# EAGLE design ARE_entrenadora_modular_doblecara_bis (EAGLE 6.1)
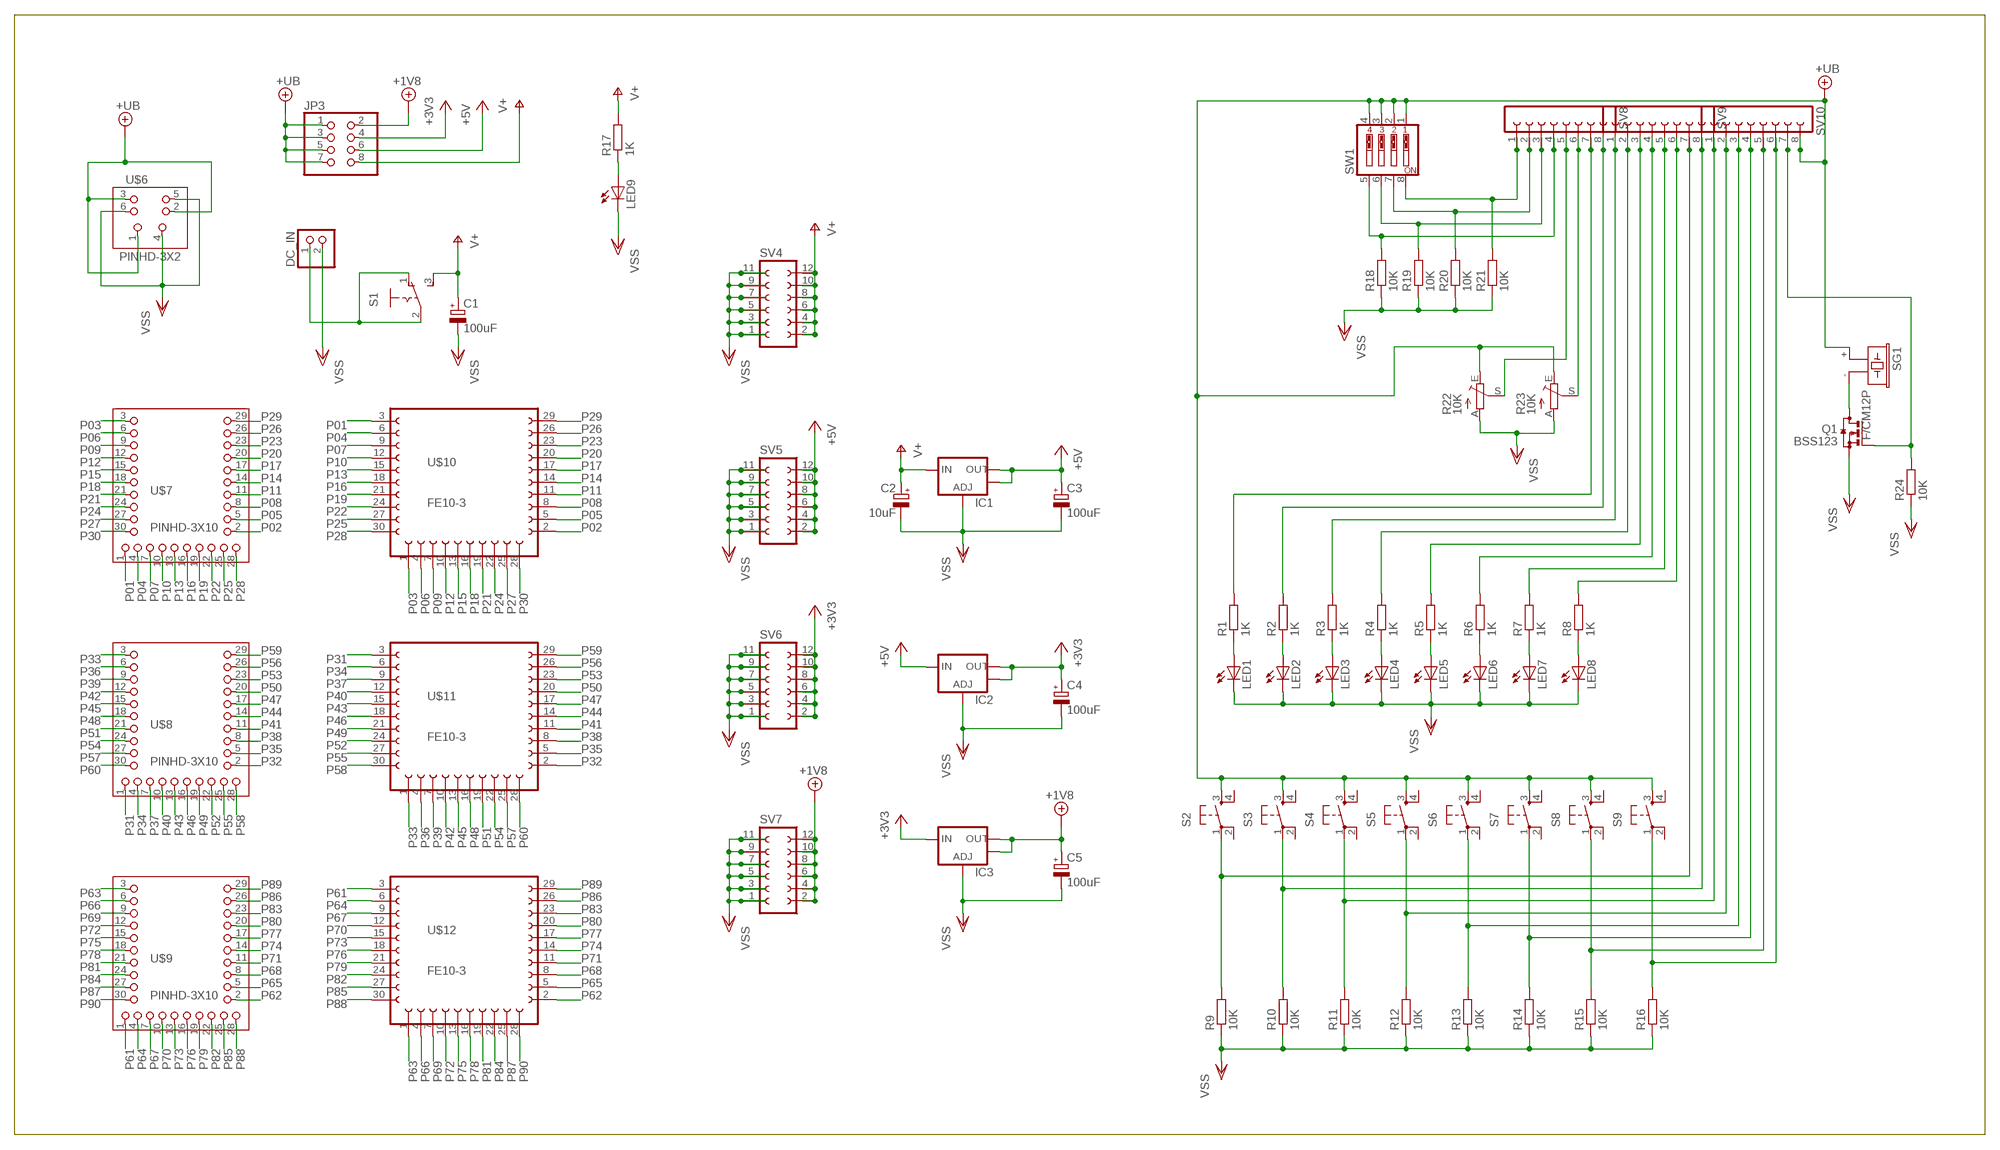
[diagram p0: schematic, sheet 1]

## Parts
C1  100uF  CPOL-EUE2.5-6  [E2,5-6]
C2  10uF  CPOL-EUSMCC  [SMC_C]
C3  100uF  CPOL-EUCT7343  [CT7343]
C4  100uF  CPOL-EUCT7343  [CT7343]
C5  100uF  CPOL-EUCT7343  [CT7343]
DC_IN  PINHD-1X2/90  [1X02/90]
IC1  V_REG_LM1117SOT223  [SOT223]
IC2  V_REG_LM1117SOT223  [SOT223]
IC3  V_REG_LM1117SOT223  [SOT223]
JP3  PINHD-2X4  [2X04]
LED1  LEDCHIP-LED0805  [CHIP-LED0805]
LED2  LEDCHIP-LED0805  [CHIP-LED0805]
LED3  LEDCHIP-LED0805  [CHIP-LED0805]
LED4  LEDCHIP-LED0805  [CHIP-LED0805]
LED5  LEDCHIP-LED0805  [CHIP-LED0805]
LED6  LEDCHIP-LED0805  [CHIP-LED0805]
LED7  LEDCHIP-LED0805  [CHIP-LED0805]
LED8  LEDCHIP-LED0805  [CHIP-LED0805]
LED9  LEDCHIP-LED0805  [CHIP-LED0805]
Q1  BSS123  [SOT23]
R1  1K  R-EU_R0805  [R0805]
R2  1K  R-EU_R0805  [R0805]
R3  1K  R-EU_R0805  [R0805]
R4  1K  R-EU_R0805  [R0805]
R5  1K  R-EU_R0805  [R0805]
R6  1K  R-EU_R0805  [R0805]
R7  1K  R-EU_R0805  [R0805]
R8  1K  R-EU_R0805  [R0805]
R9  10K  R-EU_R0805  [R0805]
R10  10K  R-EU_R0805  [R0805]
R11  10K  R-EU_R0805  [R0805]
R12  10K  R-EU_R0805  [R0805]
R13  10K  R-EU_R0805  [R0805]
R14  10K  R-EU_R0805  [R0805]
R15  10K  R-EU_R0805  [R0805]
R16  10K  R-EU_R0805  [R0805]
R17  1K  R-EU_R0805  [R0805]
R18  10K  R-EU_R0805  [R0805]
R19  10K  R-EU_R0805  [R0805]
R20  10K  R-EU_R0805  [R0805]
R21  10K  R-EU_R0805  [R0805]
R22  10K  TRIM_EU-CA6V  [CA6V]
R23  10K  TRIM_EU-CA6V  [CA6V]
R24  10K  R-EU_R0805  [R0805]
S1  255SB  [255SB]
S2  TAC_SWITCHPTH  [TACTILE-PTH]
S3  TAC_SWITCHPTH  [TACTILE-PTH]
S4  TAC_SWITCHPTH  [TACTILE-PTH]
S5  TAC_SWITCHPTH  [TACTILE-PTH]
S6  TAC_SWITCHPTH  [TACTILE-PTH]
S7  TAC_SWITCHPTH  [TACTILE-PTH]
S8  TAC_SWITCHPTH  [TACTILE-PTH]
S9  TAC_SWITCHPTH  [TACTILE-PTH]
SG1  F/CM12P  [F/CM12P]
SV4  FE06-2  [FE06-2]
SV5  FE06-2  [FE06-2]
SV6  FE06-2  [FE06-2]
SV7  FE06-2  [FE06-2]
SV8  FE08-1  [FE08]
SV9  FE08-1  [FE08]
SV10  FE08-1  [FE08]
SW1  SW_DIP-4  [EDG-04]
U$6  PINHD-3X2  [3X02/90]
U$7  PINHD-3X10  [3X10/90]
U$8  PINHD-3X10  [3X10/90]
U$9  PINHD-3X10  [3X10/90]
U$10  FE10-3  [FE10-3]
U$11  FE10-3  [FE10-3]
U$12  FE10-3  [FE10-3]

## Nets
+3V3: C4.+ IC2.2(OUT) IC2.4(OUT) IC3.3(IN) JP3.4 SV6.2 SV6.4 SV6.6 SV6.8 SV6.10 SV6.12
+5V: C3.+ IC1.2(OUT) IC1.4(OUT) IC2.3(IN) JP3.6 SV5.2 SV5.4 SV5.6 SV5.8 SV5.10 SV5.12
+18V: C5.+ IC3.2(OUT) IC3.4(OUT) JP3.2 SV7.2 SV7.4 SV7.6 SV7.8 SV7.10 SV7.12 ; supply symbol labelled +1V8
+UB: JP3.1 JP3.3 JP3.5 JP3.7 R22.E R23.E S2.3 S3.3 S4.3 S5.3 S6.3 S7.3 S8.3 S9.3 SG1.+ SV10.8 SW1.1 SW1.2 SW1.3 SW1.4 U$6.1 U$6.2 U$6.3
N$1: LED1.A R1.1
N$2: LED2.A R2.1
N$3: LED3.A R3.1
N$4: LED4.A R4.1
N$5: R2.2 SV8.8
N$6: R3.2 SV9.1
N$7: R1.2 SV8.7
N$8: R4.2 SV9.2
N$9: LED9.A R17.1
N$18: Q1.3(D) SG1.-
N$42: DC_IN.1 S1.1(O) S1.2(P)
N$43: LED5.A R5.1
N$44: LED6.A R6.1
N$45: LED7.A R7.1
N$46: LED8.A R8.1
N$47: R9.2 S2.1 SV9.7
N$48: R10.2 S3.1 SV9.8
N$49: R11.2 S4.1 SV10.1
N$50: R12.2 S5.1 SV10.2
N$51: R13.2 S6.1 SV10.3
N$52: R14.2 S7.1 SV10.4
N$53: R15.2 S8.1 SV10.5
N$54: R16.2 S9.1 SV10.6
N$55: Q1.1(G) R24.2 SV10.7
N$56: R23.S SV8.6
N$57: R22.S SV8.5
N$62: R6.2 SV9.4
N$63: R7.2 SV9.5
N$64: R5.2 SV9.3
N$65: R8.2 SV9.6
N$147: R18.2 SV8.4 SW1.5
N$148: R19.2 SV8.3 SW1.6
N$149: R20.2 SV8.2 SW1.7
N$150: R21.2 SV8.1 SW1.8
P01: U$7.1 U$10.3
P02: U$7.2 U$10.2
P03: U$7.3 U$10.1
P04: U$7.4 U$10.6
P05: U$7.5 U$10.5
P06: U$7.6 U$10.4
P07: U$7.7 U$10.9
P08: U$7.8 U$10.8
P09: U$7.9 U$10.7
P10: U$7.10 U$10.12
P11: U$7.11 U$10.11
P12: U$7.12 U$10.10
P13: U$7.13 U$10.15
P14: U$7.14 U$10.14
P15: U$7.15 U$10.13
P16: U$7.16 U$10.18
P17: U$7.17 U$10.17
P18: U$7.18 U$10.16
P19: U$7.19 U$10.21
P20: U$7.20 U$10.20
P21: U$7.21 U$10.19
P22: U$7.22 U$10.24
P23: U$7.23 U$10.23
P24: U$7.24 U$10.22
P25: U$7.25 U$10.27
P26: U$7.26 U$10.26
P27: U$7.27 U$10.25
P28: U$7.28 U$10.30
P29: U$7.29 U$10.29
P30: U$7.30 U$10.28
P31: U$8.1 U$11.3
P32: U$8.2 U$11.2
P33: U$8.3 U$11.1
P34: U$8.4 U$11.6
P35: U$8.5 U$11.5
P36: U$8.6 U$11.4
P37: U$8.7 U$11.9
P38: U$8.8 U$11.8
P39: U$8.9 U$11.7
P40: U$8.10 U$11.12
P41: U$8.11 U$11.11
P42: U$8.12 U$11.10
P43: U$8.13 U$11.15
P44: U$8.14 U$11.14
P45: U$8.15 U$11.13
P46: U$8.16 U$11.18
P47: U$8.17 U$11.17
P48: U$8.18 U$11.16
P49: U$8.19 U$11.21
P50: U$8.20 U$11.20
P51: U$8.21 U$11.19
P52: U$8.22 U$11.24
P53: U$8.23 U$11.23
P54: U$8.24 U$11.22
P55: U$8.25 U$11.27
P56: U$8.26 U$11.26
P57: U$8.27 U$11.25
P58: U$8.28 U$11.30
P59: U$8.29 U$11.29
P60: U$8.30 U$11.28
P61: U$9.1 U$12.3
P62: U$9.2 U$12.2
P63: U$9.3 U$12.1
P64: U$9.4 U$12.6
P65: U$9.5 U$12.5
P66: U$9.6 U$12.4
P67: U$9.7 U$12.9
P68: U$9.8 U$12.8
P69: U$9.9 U$12.7
P70: U$9.10 U$12.12
P71: U$9.11 U$12.11
P72: U$9.12 U$12.10
P73: U$9.13 U$12.15
P74: U$9.14 U$12.14
P75: U$9.15 U$12.13
P76: U$9.16 U$12.18
P77: U$9.17 U$12.17
P78: U$9.18 U$12.16
P79: U$9.19 U$12.21
P80: U$9.20 U$12.20
P81: U$9.21 U$12.19
P82: U$9.22 U$12.24
P83: U$9.23 U$12.23
P84: U$9.24 U$12.22
P85: U$9.25 U$12.27
P86: U$9.26 U$12.26
P87: U$9.27 U$12.25
P88: U$9.28 U$12.30
P89: U$9.29 U$12.29
P90: U$9.30 U$12.28
V+: C1.+ C2.+ IC1.3(IN) JP3.8 R17.2 S1.3(S) SV4.2 SV4.4 SV4.6 SV4.8 SV4.10 SV4.12
VSS: C1.- C2.- C3.- C4.- C5.- DC_IN.2 IC1.1(ADJ) IC2.1(ADJ) IC3.1(ADJ) LED1.C LED2.C LED3.C LED4.C LED5.C LED6.C LED7.C LED8.C LED9.C Q1.2(S) R9.1 R10.1 R11.1 R12.1 R13.1 R14.1 R15.1 R16.1 R18.1 R19.1 R20.1 R21.1 R22.A R23.A R24.1 SV4.1 SV4.3 SV4.5 SV4.7 SV4.9 SV4.11 SV5.1 SV5.3 SV5.5 SV5.7 SV5.9 SV5.11 SV6.1 SV6.3 SV6.5 SV6.7 SV6.9 SV6.11 SV7.1 SV7.3 SV7.5 SV7.7 SV7.9 SV7.11 U$6.4 U$6.5 U$6.6
Unconnected: S2.2 S2.4 S3.2 S3.4 S4.2 S4.4 S5.2 S5.4 S6.2 S6.4 S7.2 S7.4 S8.2 S8.4 S9.2 S9.4

## Library data of the parts
C1-C5 = rcl:CPOL-EU: POLARIZED CAPACITOR, European symbol
DC_IN = pinhead:PINHD-1X2: PIN HEADER
IC1-IC3 = SparkFun:V_REG_LM1117: Voltage Regulator LM1117 Standard adjustable voltage regulator but in SMD form. Spark Fun Electronics SKU : COM-00595
JP3 = pinhead:PINHD-2X4: PIN HEADER
LED1-LED9 = led:LED: LED OSRAM: - CHIPLED LG R971, LG N971, LY N971, LG Q971, LY Q971, LO R971, LY R971 LH N974, LH R974 LS Q976, LO Q976, LY Q976 LO Q996 - Hyper CHIPLED LW Q18S LB Q993, LB Q99A, LB R99A - SideLED LS A670, LO A670, LY A670, LG A670, LP A670 LB A673, LV A673, LT A673, LW A673 LH A674 LY A675 LS A676, LA A676, LO A676, LY A676, LW A676 LS A679, LY A679, LG A679 - Hyper Micro SIDELED® LS Y876, LA Y876, LO Y876, LY Y876 LT Y87S - SmartLED LW L88C, LW L88S LB L89C, LB L89S, LG L890 LS L89K, LO L89K, LY L89K LS L896, LA L896, LO L896, LY L896 - TOPLED LS T670, LO T670, LY T670, LG T670, LP T670 LSG T670, LSP T670, LSY T670, LOP T670, LYG T670 LG T671, LOG T671, LSG T671 LB T673, LV T673, LT T673, LW T673 LH T674 LS T676, LA T676, LO T676, LY T676, LB T676, LH T676, LSB T676, LW T676 LB T67C, LV T67C, LT T67C, LS T67K, LO T67K, LY T67K, LW E67C LS E67B, LA E67B, LO E67B, LY E67B, LB E67C, LV E67C, LT E67C LW T67C LS T679, LY T679, LG T679 LS T770, LO T770, LY T770, LG T770, LP T770 LB T773, LV T773, LT T773, LW T773 LH T774 LS E675, LA E675, LY E675, LS T675 LS T776, LA T776, LO T776, LY T776, LB T776 LHGB T686 LT T68C, LB T68C - Hyper Mini TOPLED® LB M676 - Mini TOPLED Santana® LG M470 LS M47K, LO M47K, LY M47K Source: http://www.osram.convergy.de LUXEON: - LUMILED® LXK2-PW12-R00, LXK2-PW12-S00, LXK2-PW14-U00, LXK2-PW14-V00 LXK2-PM12-R00, LXK2-PM12-S00, LXK2-PM14-U00 LXK2-PE12-Q00, LXK2-PE12-R00, LXK2-PE12-S00, LXK2-PE14-T00, LXK2-PE14-U00 LXK2-PB12-K00, LXK2-PB12-L00, LXK2-PB12-M00, LXK2-PB14-N00, LXK2-PB14-P00, LXK2-PB14-Q00 LXK2-PR12-L00, LXK2-PR12-M00, LXK2-PR14-Q00, LXK2-PR14-R00 LXK2-PD12-Q00, LXK2-PD12-R00, LXK2-PD12-S00 LXK2-PH12-R00, LXK2-PH12-S00 LXK2-PL12-P00, LXK2-PL12-Q00, LXK2-PL12-R00 Source: www.luxeon.com KINGBRIGHT: KA-3528ASYC Source: www.kingbright.com
Q1 = transistor-small-signal:BSS123: N-CHANNEL MOS FET
R1-R21 R24 = rcl:R-EU_: RESISTOR, European symbol
R22 R23 = pot:TRIM_EU-: POTENTIOMETER
S1 = switch:255SB: SLIDING SWITCH Distributor Buerklin, 11G810
S2-S9 = SparkFun:TAC_SWITCH: Momentary Switch Button commonly used for reset or general input. Spark Fun Electronics SKU : COM-00097
SG1 = buzzer:F/CM12P: BUZZER Source: Buerklin; OC_FARNELL: unknown; OC_NEWARK: unknown
SV4-SV7 = con-lsta:FE06-2: FEMALE HEADER; OC_FARNELL: unknown; OC_NEWARK: unknown
SV8-SV10 = con-lsta:FE08-1: FEMALE HEADER; OC_FARNELL: unknown; OC_NEWARK: unknown
SW1 = special:SW_DIP-4: DIP SWITCH
U$6 = pinhead:PINHD-3X2
U$7-U$9 = pinhead:PINHD-3X10
U$10-U$12 = con-lsta:FE10-3

## Board
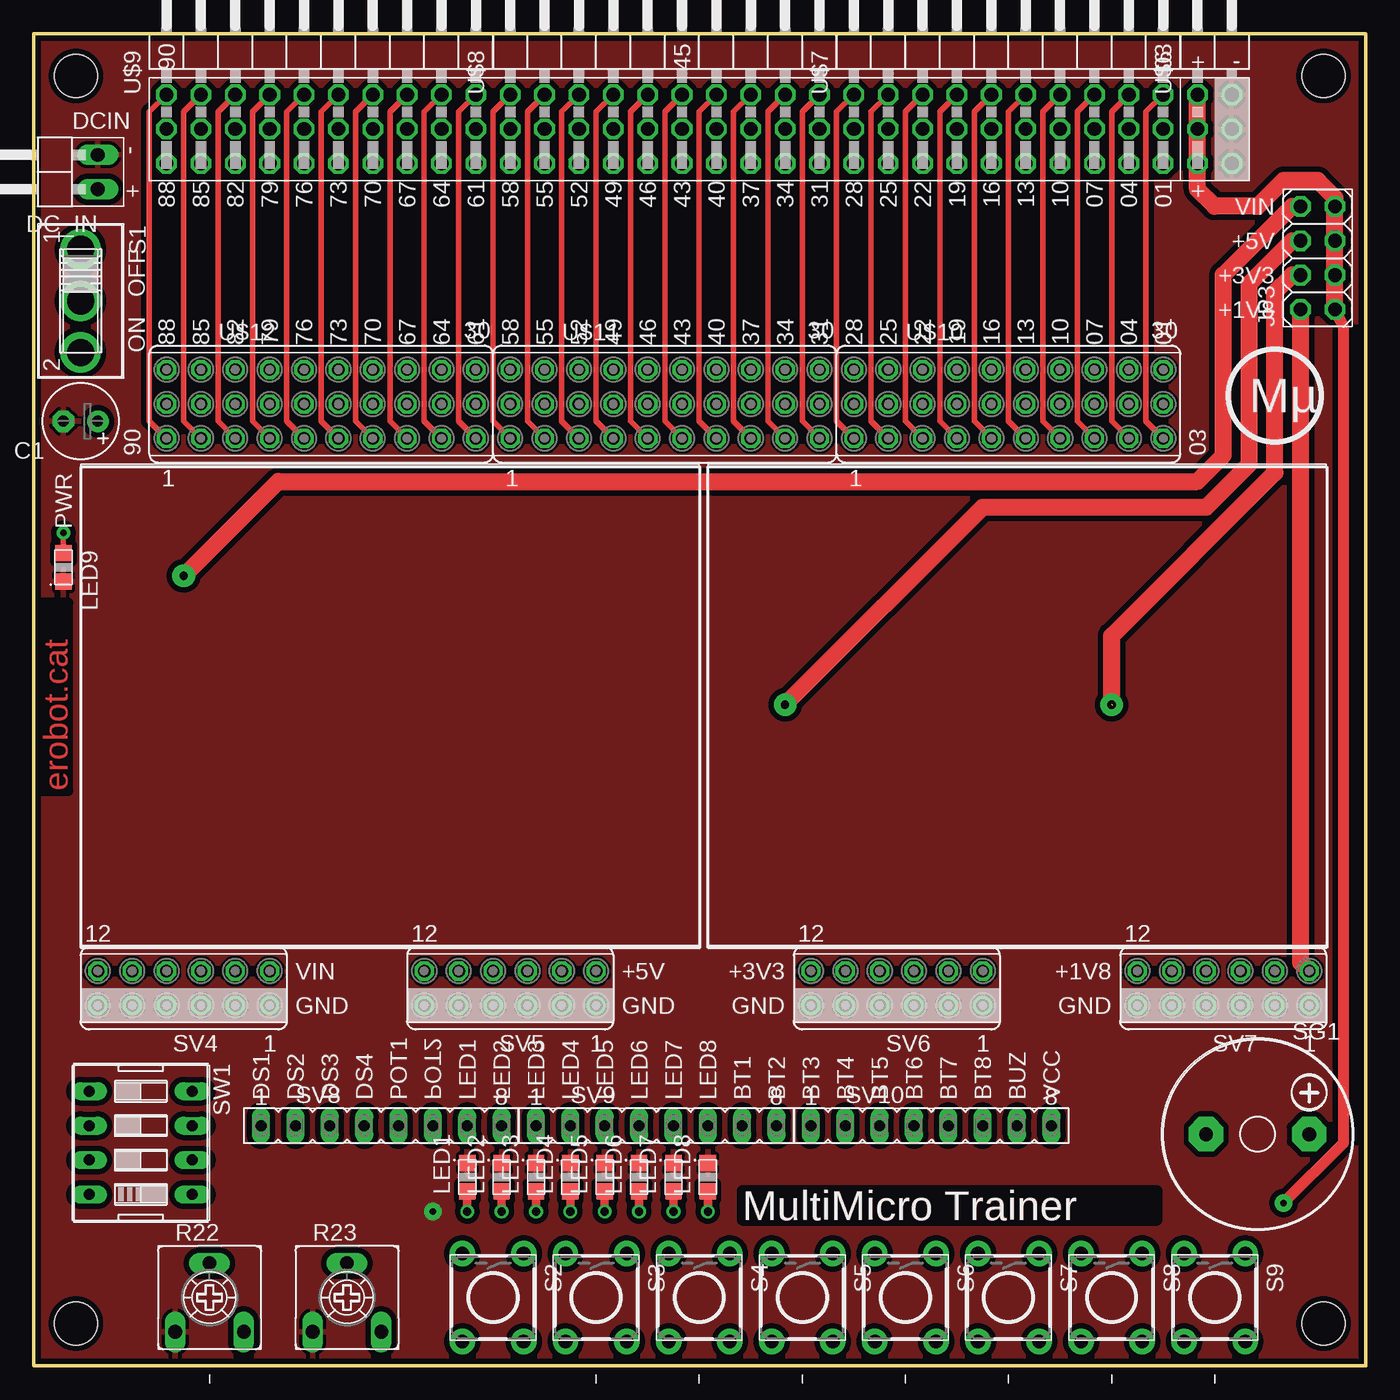
[diagram p1: board, top side]
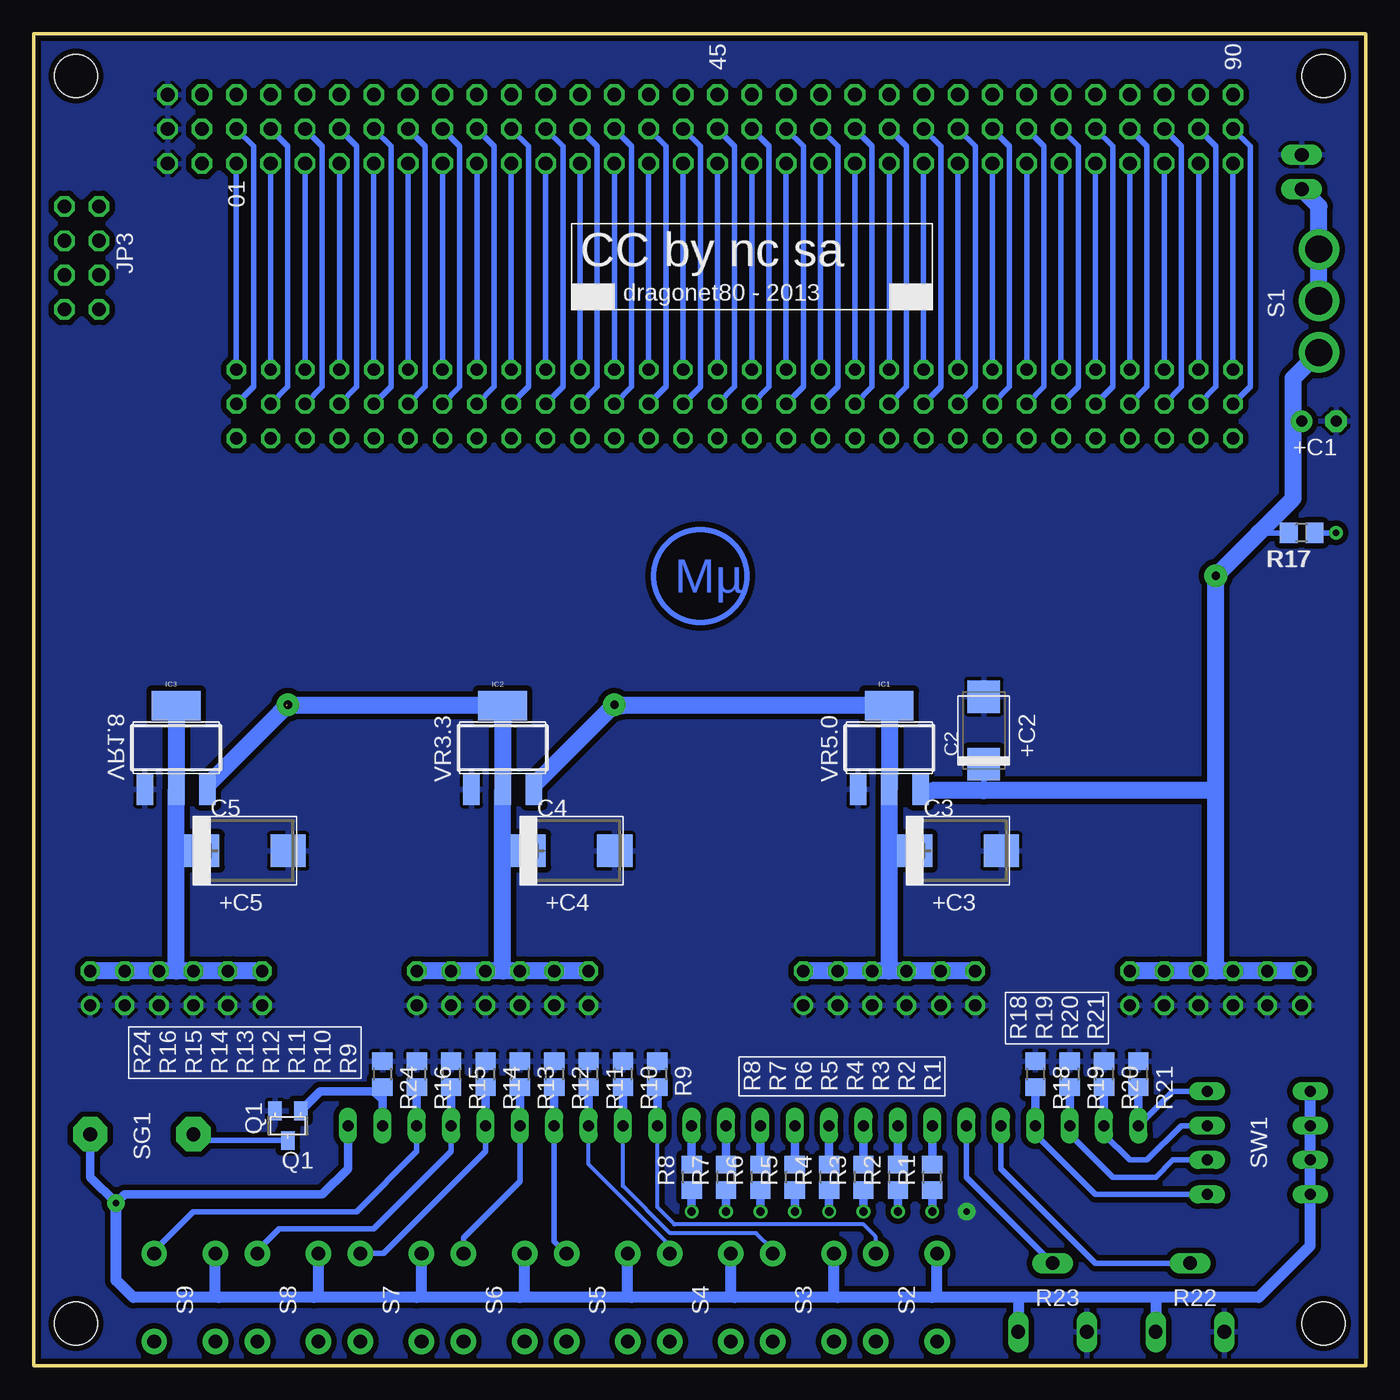
[diagram p2: board, bottom side, seen from below]

Size 98.44 x 98.44 mm. Coordinates in mm from the lower left corner, seen from the top.
Outline: 0,98.44 98.44,98.44 98.44,0 0,0 0,98.44
Copper layers (1*16): Top 0.035mm / dielectric 1.5mm / Bottom 0.035mm
Design rules: minimum track width 6mil, minimum drill 12mil, track to track 6mil, track to pad 6mil, pad to pad 6mil, via to via 6mil, smd to smd 0mil, copper to edge 10mil, drill to drill 10mil, minimum pad ring 10mil, minimum via ring 6mil, stop-mask expansion 2mil, vias tented up to drill 100mil, thermal gap 10mil
Holes 3.2 mm at 3.12,3.12 3.12,95.31 95.31,3.12 95.31,95.31

### Footprints (pad centres in the part's own frame; a part is rotated, then mirrored left to right if it is on the bottom)
E2,5-6 = drill 0.813 pad 1.6: + -1.27,0 | drill 0.813 pad 1.6 octagon: - 1.27,0
SMC_C = smd 2.4 x 2.4: + -2.5,0; - 2.5,0
CT7343 = smd 2.6 x 2.4: + -3.2,0; - 3.2,0
1X02/90 = drill 1.016 long: 1 -1.27,-3.81; 2 1.27,-3.81
SOT223 = smd 1.219 x 2.235: 1 -2.311,-3.099; 2 0,-3.099; 3 2.311,-3.099 | smd 3.6 x 2.2: 4 0,3.099
2X04 = drill 1.016 octagon: 1 -3.81,-1.27; 2 -3.81,1.27; 3 -1.27,-1.27; 4 -1.27,1.27; 5 1.27,-1.27; 6 1.27,1.27; 7 3.81,-1.27; 8 3.81,1.27
CHIP-LED0805 = smd 1.2 x 1.2: A 0,-1.05; C 0,1.05
SOT23 = smd 1 x 1.4: 1 -0.95,-1.1; 2 0.95,-1.1; 3 0,1.1
R0805 = smd 1.3 x 1.5: 1 -0.95,0; 2 0.95,0
CA6V = drill 1.016 long: A -2.54,-2.54; E 2.54,-2.54; S 0,2.54
255SB = drill 2: 1 -3.81,0; 2 0,0; 3 3.81,0
TACTILE-PTH = drill 1.016 pad 1.88: 1 -3.251,2.261; 2 3.251,2.261; 3 -3.251,-2.261; 4 3.251,-2.261
F/CM12P = drill 1.016 pad 2.54 octagon: + 3.81,0; - -3.81,0
FE06-2 = drill 0.914: 1 -6.35,1.27 | drill 0.914 octagon: 2 -6.35,-1.27; 3 -3.81,1.27; 4 -3.81,-1.27; 5 -1.27,1.27; 6 -1.27,-1.27; 7 1.27,1.27; 8 1.27,-1.27; 9 3.81,1.27; 10 3.81,-1.27; 11 6.35,1.27; 12 6.35,-1.27
FE08 = drill 0.813 long: 1 -8.89,0; 2 -6.35,0; 3 -3.81,0; 4 -1.27,0; 5 1.27,0; 6 3.81,0; 7 6.35,0; 8 8.89,0
EDG-04 = drill 0.813 long: 1 -3.81,-3.81; 2 -1.27,-3.81; 3 1.27,-3.81; 4 3.81,-3.81; 5 3.81,3.81; 6 1.27,3.81; 7 -1.27,3.81; 8 -3.81,3.81
3X02/90 = drill 1.016 octagon: 1 -1.27,-1.27; 2 -1.27,1.27; 3 -1.27,3.81; 4 1.27,-1.27; 5 1.27,1.27; 6 1.27,3.81
3X10/90 = drill 1.016 octagon: 1 -11.43,-1.27; 2 -11.43,1.27; 3 -11.43,3.81; 4 -8.89,-1.27; 5 -8.89,1.27; 6 -8.89,3.81; 7 -6.35,-1.27; 8 -6.35,1.27; 9 -6.35,3.81; 10 -3.81,-1.27; 11 -3.81,1.27; 12 -3.81,3.81; 13 -1.27,-1.27; 14 -1.27,1.27; 15 -1.27,3.81; 16 1.27,-1.27; 17 1.27,1.27; 18 1.27,3.81; 19 3.81,-1.27; 20 3.81,1.27; 21 3.81,3.81; 22 6.35,-1.27; 23 6.35,1.27; 24 6.35,3.81; 25 8.89,-1.27; 26 8.89,1.27; 27 8.89,3.81; 28 11.43,-1.27; 29 11.43,1.27; 30 11.43,3.81
FE10-3 = drill 0.914 octagon: 1 -11.43,-1.27; 2 -11.43,1.27; 3 -11.43,3.81; 4 -8.89,-1.27; 5 -8.89,1.27; 6 -8.89,3.81; 7 -6.35,-1.27; 8 -6.35,1.27; 9 -6.35,3.81; 10 -3.81,-1.27; 11 -3.81,1.27; 12 -3.81,3.81; 13 -1.27,-1.27; 14 -1.27,1.27; 15 -1.27,3.81; 16 1.27,-1.27; 17 1.27,1.27; 18 1.27,3.81; 19 3.81,-1.27; 20 3.81,1.27; 21 3.81,3.81; 22 6.35,-1.27; 23 6.35,1.27; 24 6.35,3.81; 25 8.89,-1.27; 26 8.89,1.27; 27 8.89,3.81; 28 11.43,-1.27; 29 11.43,1.27; 30 11.43,3.81

### Placement (x,y rotation side)
C1  3.46,69.81 180 top
C2  28.22,46.95 90 bottom
C3  30.13,38.06 0 bottom
C4  58.7,38.06 0 bottom
C5  82.84,38.06 0 bottom
DC_IN  0.92,88.22 90 top
IC1  35.21,45.68 0 bottom
IC2  63.79,45.68 0 bottom
IC3  87.92,45.68 0 bottom
JP3  94.9,81.87 90 top
LED1  32.03,13.93 0 top
LED2  34.57,13.93 0 top
LED3  37.12,13.93 0 top
LED4  39.66,13.93 0 top
LED5  42.2,13.93 0 top
LED6  44.73,13.93 0 top
LED7  47.27,13.93 0 top
LED8  49.81,13.93 0 top
LED9  2.19,59.01 180 top
Q1  79.66,17.74 180 bottom
R1  32.03,13.93 90 bottom
R2  34.57,13.93 90 bottom
R3  37.12,13.93 90 bottom
R4  39.66,13.93 90 bottom
R5  42.2,13.93 90 bottom
R6  44.73,13.93 90 bottom
R7  47.27,13.93 90 bottom
R8  49.81,13.93 90 bottom
R9  52.35,21.55 270 bottom
R10  54.89,21.55 270 bottom
R11  57.43,21.55 270 bottom
R12  59.98,21.55 270 bottom
R13  62.52,21.55 270 bottom
R14  65.06,21.55 270 bottom
R15  67.59,21.55 270 bottom
R16  70.14,21.55 270 bottom
R17  4.73,61.55 180 bottom
R18  24.41,21.55 270 bottom
R19  21.88,21.55 270 bottom
R20  19.33,21.55 270 bottom
R21  16.79,21.55 270 bottom
R22  12.99,5.04 0 top
R23  23.14,5.04 0 top
R24  72.68,21.55 270 bottom
S1  3.46,78.7 270 top
S2  33.94,5.04 270 top
S3  41.56,5.04 270 top
S4  49.18,5.04 270 top
S5  56.8,5.04 270 top
S6  64.42,5.04 270 top
S7  72.04,5.04 270 top
S8  79.66,5.04 270 top
S9  87.28,5.04 270 top
SG1  90.46,17.1 0 top
SV4  11.08,27.9 180 top
SV5  35.21,27.9 180 top
SV6  63.79,27.9 180 top
SV7  87.92,27.9 180 top
SV8  25.68,17.74 0 top
SV9  46,17.74 0 top
SV10  66.33,17.74 0 top
SW1  7.91,16.47 270 top
U$2  BREADBOARDMINI  [BREADBOARD-MINI]  3.49,30.89 0 top
U$3  BREADBOARDMINI  [BREADBOARD-MINI]  49.84,30.89 0 top
U$6  87.28,90.13 0 top
U$7  72.04,90.13 0 top
U$8  46.64,90.13 0 top
U$9  21.24,90.13 0 top
U$10  72.04,69.81 0 top
U$11  46.64,69.81 0 top
U$12  21.24,69.81 0 top

### Tracks (layer width: path | path; a pad name or v marks a point on that pad's centre or on a via)
+3V3  (via drill 0.6 pad 1.68)  (1 unrouted)
  Top 1.27: JP3.4 93,80.6 91.73,79.33 91.73,66 79.66,53.93 v79.66,48.85
  Bottom 0.406: C4.+ 63.79,38.06
  Bottom 1.27: SV6.12 SV6.10 SV6.8 63.79,29.17 | SV6.2 SV6.4 SV6.6 63.79,29.17 | 63.79,29.17 63.79,38.06 IC2.2 IC2.4 79.74,48.78 80.3,48.22 85.6,42.91 IC3.3
+5V  (via drill 0.6 pad 1.68)
  Top 1.27: JP3.6 93,83.14 89.82,79.97 89.82,66.63 86.65,63.46 70.14,63.46 v55.53,48.85
  Bottom 0.406: C3.+ 35.21,38.06
  Bottom 1.27: SV5.12 SV5.10 SV5.8 35.21,29.17 | SV5.2 SV5.4 SV5.6 35.21,29.17 | 35.21,29.17 35.21,38.06 IC1.2 IC1.4 54.89,48.78 55.45,48.78 | 55.45,48.78 55.61,48.78 61.47,42.91 IC2.3 | v55.53,48.85 55.45,48.78
+18V
  Top 1.27: JP3.2 93.63,29.8 SV7.2
  Bottom 0.406: C5.+ 87.92,38.06
  Bottom 1.27: SV7.12 SV7.10 SV7.8 87.92,29.17 | SV7.2 SV7.4 SV7.6 87.92,29.17 | IC3.4 IC3.2 87.92,38.06 87.92,29.17
+UB  (via drill 0.5 pad 1.27)
  Top 0.813: JP3.1 96.81,76.79 96.81,16.47 v92.36,12.02
  Top 1.27: JP3.1 JP3.3 JP3.5 JP3.7 96.17,86.32 94.9,87.59 92.36,87.59 90.46,85.68 87.28,85.68 86.01,86.95 U$6.1 U$6.2 U$6.3
  Bottom 0.61: 84.74,5.04 85.02,5.32 | 77.76,5.04 77.4,5.39 | 70.14,5.04 69.78,5.39 | 62.52,5.04 62.16,5.39 | 54.26,5.04 54.54,5.32 | 46.64,5.04 46.92,5.32 | 39.02,5.04 39.3,5.32 | SG1.+ 94.27,13.93 v92.36,12.02 91.73,12.66 77.12,12.66 75.22,14.56 SV10.8
  Bottom 0.813: SW1.1 SW1.2 SW1.3 SW1.4 4.1,8.85 7.91,5.04 15.53,5.04 | 15.53,5.04 25.68,5.04 | 32.03,5.04 39.02,5.04 46.64,5.04 54.26,5.04 62.52,5.04 70.14,5.04 77.76,5.04 84.74,5.04 91.09,5.04 92.36,6.31 v92.36,12.02 | 85.02,5.32 S9.3 | 77.4,5.39 S8.3 | 69.78,5.39 S7.3 | 62.16,5.39 S6.3 | 54.54,5.32 S5.3 | 46.92,5.32 S4.3 | 39.3,5.32 S3.3 | S2.3 31.68,5.32 32.03,5.04 | 25.68,5.04 R23.E | 15.53,5.04 R22.E | 25.68,5.04 32.03,5.04
N$1  (via drill 0.6 pad 1.02)
  Top 0.61: v32.03,11.39 LED1.A
  Bottom 0.61: v32.03,11.39 R1.1
N$2  (via drill 0.6 pad 1.02)
  Top 0.61: v34.57,11.39 LED2.A
  Bottom 0.61: v34.57,11.39 R2.1
N$3  (via drill 0.6 pad 1.02)
  Top 0.61: v37.12,11.39 LED3.A
  Bottom 0.61: v37.12,11.39 R3.1
N$4  (via drill 0.6 pad 1.02)
  Top 0.61: v39.66,11.39 LED4.A
  Bottom 0.61: v39.66,11.39 R4.1
N$5
  Bottom 0.61: R2.2 SV8.8
N$6
  Bottom 0.61: R3.2 SV9.1
N$7
  Bottom 0.61: R1.2 SV8.7
N$8
  Bottom 0.61: R4.2 SV9.2
N$9  (via drill 0.5 pad 1.02)
  Top 0.406: v2.19,61.55 LED9.A
  Bottom 0.406: R17.1 v2.19,61.55
N$18
  Bottom 0.406: Q1.3 86.18,16.64 SG1.-
N$42
  Bottom 1.27: DC_IN.1 3.46,85.68 S1.1 S1.2
N$43  (via drill 0.6 pad 1.02)
  Top 0.61: v42.2,11.39 LED5.A
  Bottom 0.61: v42.2,11.39 R5.1
N$44  (via drill 0.6 pad 1.02)
  Top 0.61: v44.73,11.39 LED6.A
  Bottom 0.61: v44.73,11.39 R6.1
N$45  (via drill 0.6 pad 1.02)
  Top 0.61: v47.27,11.39 LED7.A
  Bottom 0.61: v47.27,11.39 R7.1
N$46  (via drill 0.6 pad 1.02)
  Top 0.61: v49.81,11.39 LED8.A
  Bottom 0.61: v49.81,11.39 R8.1
N$47
  Bottom 0.305: S2.1 36.2,9.52 37.12,10.44 51.09,10.44 52.35,11.71 SV9.7
  Bottom 0.61: SV9.7 R9.2
N$48
  Bottom 0.305: S3.1 43.82,8.57 45.05,9.8 51.4,9.8 54.89,13.29 SV9.8
  Bottom 0.61: SV9.8 R10.2
N$49
  Bottom 0.305: S4.1 51.44,8.89 57.43,14.88 SV10.1
  Bottom 0.61: SV10.1 R11.2
N$50
  Bottom 0.406: S5.1 59.98,9.2 SV10.2
  Bottom 0.61: SV10.2 R12.2
N$51
  Bottom 0.406: S6.1 66.68,9.44 62.52,13.61 SV10.3
  Bottom 0.61: SV10.3 R13.2
N$52
  Bottom 0.406: S7.1 72.6,8.29 65.06,15.83 SV10.4
  Bottom 0.61: SV10.4 R14.2
N$53
  Bottom 0.406: S8.1 81.92,8.49 80.3,10.12 73.31,10.12 67.59,15.83 SV10.5
  Bottom 0.61: SV10.5 R15.2
N$54
  Bottom 0.406: S9.1 89.54,8.49 86.65,11.39 74.58,11.39 70.14,15.83 SV10.6
  Bottom 0.61: SV10.6 R16.2
N$55
  Bottom 0.61: SV10.7 72.68,19.64 | 72.68,19.64 73.31,20.28 77.27,20.28 Q1.1 | 72.68,19.64 R24.2
N$56
  Bottom 0.406: R23.S 29.49,13.93 SV8.6
N$57
  Bottom 0.406: R22.S 19.97,7.58 26.95,14.56 SV8.5
N$62
  Bottom 0.61: R6.2 SV9.4
N$63
  Bottom 0.61: R7.2 SV9.5
N$64
  Bottom 0.61: R5.2 SV9.3
N$65
  Bottom 0.61: R8.2 SV9.6
N$147
  Bottom 0.406: SW1.5 19.97,12.66 24.41,17.1 SV8.4
  Bottom 0.61: SV8.4 R18.2
N$148
  Bottom 0.406: SW1.6 14.26,15.2 15.53,13.93 18.7,13.93 21.88,17.1 SV8.3
  Bottom 0.61: SV8.3 R19.2
N$149
  Bottom 0.406: SW1.7 13.62,17.74 16.16,15.2 17.43,15.2 19.33,17.1 SV8.2
  Bottom 0.61: SV8.2 R20.2
N$150
  Bottom 0.406: SW1.8 14.26,20.28 SV8.1
  Bottom 0.61: SV8.1 R21.2
P01
  Bottom 0.406: U$7.1 U$10.3
P02
  Bottom 0.406: U$7.2 59.34,90.13 59.34,72.35 U$10.2
P03
  Top 0.406: U$7.3 59.34,92.67 59.34,69.81 U$10.1
P04
  Bottom 0.406: U$7.4 U$10.6
P05
  Bottom 0.406: U$7.5 61.88,90.13 61.88,72.35 U$10.5
P06
  Top 0.406: U$7.6 61.88,92.67 61.88,69.81 U$10.4
P07
  Bottom 0.406: U$7.7 U$10.9
P08
  Bottom 0.406: U$7.8 64.42,90.13 64.42,72.35 U$10.8
P09
  Top 0.406: U$7.9 64.42,92.67 64.42,69.81 U$10.7
P10
  Bottom 0.406: U$7.10 U$10.12
P11
  Bottom 0.406: U$7.11 66.96,90.13 66.96,72.35 U$10.11
P12
  Top 0.406: U$7.12 66.96,92.67 66.96,69.81 U$10.10
P13
  Bottom 0.406: U$7.13 U$10.15
P14
  Bottom 0.406: U$7.14 69.5,90.13 69.5,72.35 U$10.14
P15
  Top 0.406: U$7.15 69.5,92.67 69.5,69.81 U$10.13
P16
  Bottom 0.406: U$7.16 U$10.18
P17
  Bottom 0.406: U$7.17 72.04,90.13 72.04,72.35 U$10.17
P18
  Top 0.406: U$7.18 72.04,92.67 72.04,69.81 U$10.16
P19
  Bottom 0.406: U$7.19 U$10.21
P20
  Bottom 0.406: U$7.20 74.58,90.13 74.58,72.35 U$10.20
P21
  Top 0.406: U$7.21 74.58,92.67 74.58,69.81 U$10.19
P22
  Bottom 0.406: U$7.22 U$10.24
P23
  Bottom 0.406: U$7.23 77.12,90.13 77.12,72.35 U$10.23
P24
  Top 0.406: U$7.24 77.12,92.67 77.12,69.81 U$10.22
P25
  Bottom 0.406: U$7.25 U$10.27
P26
  Bottom 0.406: U$7.26 79.66,90.13 79.66,72.35 U$10.26
P27
  Top 0.406: U$10.25 79.66,69.81 79.66,92.67 U$7.27
P28
  Bottom 0.406: U$7.28 U$10.30
P29
  Bottom 0.406: U$7.29 82.2,90.13 82.2,72.35 U$10.29
P30
  Top 0.406: U$7.30 82.2,92.67 82.2,69.81 U$10.28
P31
  Bottom 0.406: U$8.1 U$11.3
P32
  Bottom 0.406: U$8.2 33.94,90.13 33.94,72.35 U$11.2
P33
  Top 0.406: U$8.3 33.94,92.67 33.94,69.81 U$11.1
P34
  Bottom 0.406: U$8.4 U$11.6
P35
  Bottom 0.406: U$8.5 36.48,90.13 36.48,72.35 U$11.5
P36
  Top 0.406: U$8.6 36.48,92.67 36.48,69.81 U$11.4
P37
  Bottom 0.406: U$8.7 U$11.9
P38
  Bottom 0.406: U$8.8 39.02,90.13 39.02,72.35 U$11.8
P39
  Top 0.406: U$8.9 39.02,92.67 39.02,69.81 U$11.7
P40
  Bottom 0.406: U$8.10 U$11.12
P41
  Bottom 0.406: U$8.11 41.56,90.13 41.56,72.35 U$11.11
P42
  Top 0.406: U$8.12 41.56,92.67 41.56,69.81 U$11.10
P43
  Bottom 0.406: U$8.13 U$11.15
P44
  Bottom 0.406: U$8.14 44.1,90.13 44.1,72.35 U$11.14
P45
  Top 0.406: U$8.15 44.1,92.67 44.1,69.81 U$11.13
P46
  Bottom 0.406: U$8.16 U$11.18
P47
  Bottom 0.406: U$8.17 46.64,90.13 46.64,72.35 U$11.17
P48
  Top 0.406: U$8.18 46.64,92.67 46.64,69.81 U$11.16
P49
  Bottom 0.406: U$8.19 U$11.21
P50
  Bottom 0.406: U$8.20 49.18,90.13 49.18,72.35 U$11.20
P51
  Top 0.406: U$8.21 49.18,92.67 49.18,69.81 U$11.19
P52
  Bottom 0.406: U$8.22 U$11.24
P53
  Bottom 0.406: U$8.23 51.72,90.13 51.72,72.35 U$11.23
P54
  Top 0.406: U$8.24 51.72,92.67 51.72,69.81 U$11.22
P55
  Bottom 0.406: U$8.25 U$11.27
P56
  Bottom 0.406: U$8.26 54.26,90.13 54.26,72.35 U$11.26
P57
  Top 0.406: U$8.27 54.26,92.67 54.26,69.81 U$11.25
P58
  Bottom 0.406: U$8.28 U$11.30
P59
  Bottom 0.406: U$8.29 56.8,90.13 56.8,72.35 U$11.29
P60
  Top 0.406: U$8.30 56.8,92.67 56.8,69.81 U$11.28
P61
  Bottom 0.406: U$9.1 U$12.3
P62
  Bottom 0.406: U$9.2 8.54,90.13 8.54,72.35 U$12.2
P63
  Top 0.406: U$9.3 8.54,92.67 8.54,69.81 U$12.1
P64
  Bottom 0.406: U$9.4 U$12.6
P65
  Bottom 0.406: U$9.5 11.08,90.13 11.08,72.35 U$12.5
P66
  Top 0.406: U$9.6 11.08,92.67 11.08,69.81 U$12.4
P67
  Bottom 0.406: U$9.7 U$12.9
P68
  Bottom 0.406: U$9.8 13.62,90.13 13.62,72.35 U$12.8
P69
  Top 0.406: U$9.9 13.62,92.67 13.62,69.81 U$12.7
P70
  Bottom 0.406: U$9.10 U$12.12
P71
  Bottom 0.406: U$9.11 16.16,90.13 16.16,72.35 U$12.11
P72
  Top 0.406: U$9.12 16.16,92.67 16.16,69.81 U$12.10
P73
  Bottom 0.406: U$9.13 U$12.15
P74
  Bottom 0.406: U$9.14 18.7,90.13 18.7,72.35 U$12.14
P75
  Top 0.406: U$9.15 18.7,92.67 18.7,69.81 U$12.13
P76
  Bottom 0.406: U$9.16 U$12.18
P77
  Bottom 0.406: U$9.17 21.24,90.13 21.24,72.35 U$12.17
P78
  Top 0.406: U$9.18 21.24,92.67 21.24,69.81 U$12.16
P79
  Bottom 0.406: U$9.19 U$12.21
P80
  Bottom 0.406: U$9.20 23.78,90.13 23.78,72.35 U$12.20
P81
  Top 0.406: U$9.21 23.78,92.67 23.78,69.81 U$12.19
P82
  Bottom 0.406: U$9.22 U$12.24
P83
  Bottom 0.406: U$9.23 26.32,90.13 26.32,72.35 U$12.23
P84
  Top 0.406: U$9.24 26.32,92.67 26.32,69.81 U$12.22
P85
  Bottom 0.406: U$9.25 U$12.27
P86
  Bottom 0.406: U$9.26 28.86,90.13 28.86,72.35 U$12.26
P87
  Top 0.406: U$9.27 28.86,92.67 28.86,69.81 U$12.25
P88
  Bottom 0.406: U$9.28 U$12.30
P89
  Bottom 0.406: U$9.29 31.4,90.13 31.4,72.35 U$12.29
P90
  Top 0.406: U$9.30 31.4,92.67 31.4,69.81 U$12.28
V+  (via drill 0.6 pad 1.68)
  Top 1.27: JP3.8 93,85.68 87.92,80.6 87.92,67.27 86.01,65.36 18.06,65.36 v11.08,58.38
  Bottom 0.406: 7.91,61.55 R17.2 | C1.+ 5.37,69.81 | C2.+ 28.22,42.5
  Bottom 1.27: SV4.12 SV4.10 SV4.8 11.08,29.17 | SV4.2 SV4.4 SV4.6 11.08,29.17 | S1.3 5.37,72.98 5.37,69.81 5.37,64.09 7.91,61.55 v11.08,58.38 11.08,42.5 | 11.08,29.17 11.08,42.5 | 11.08,42.5 28.22,42.5 32.03,42.5 32.9,42.1 IC1.3
VSS  (via drill 0.5 pad 1.27)
  other vias: 29.49,11.39
  pour Bottom (isolate 0.406): 98.32,98.52 98.32,-1.18 -0.26,-0.7 -0.1,98.99
  pour Top (isolate 0.406): 0.29,-0.04 98.71,-0.04 98.71,98.38 0.29,98.38
(copper drawn outside any net)
  shapes: Bottom circle x1

### Text on the board
Top: erobot.cat | MultiMicro Trainer
Bottom: Mµ
_tsilk: 90 | 45 | 03 | + | - | DCIN | - | 88 | 85 | 82 | 79 | 76 | 73 | 70 | 67 | 64 | 61 | 58 | 55 | 52 | 49 | 46 | 43 | 40 | 37 | 34 | 31 | 28 | 25 | 22 | 19 | 16 | 13 | 10 | 07 | 04 | 01 | + | + | VIN | +5V | OFF | +3V3 | +1V8 | 88 | 85 | 82 | 79 | 76 | 73 | 70 | 67 | 64 | 61 | 58 | 55 | 52 | 49 | 46 | 43 | 40 | 37 | 34 | 31 | 28 | 25 | 22 | 19 | 16 | 13 | 10 | 07 | 04 | 01 | ON | Mµ | 90 | 03 | PWR | +3V3 | +1V8 | VIN | +5V | GND | GND | GND | GND | DS1 | DS2 | DS3 | DS4 | POT1 | POT2 | LED1 | LED2 | LED3 | LED4 | LED5 | LED6 | LED7 | LED8 | BT1 | BT2 | BT3 | BT4 | BT5 | BT6 | BT7 | BT8 | BUZ | VCC | MultiMicro Trainer
_bsilk: 90 | 45 | 01 | JP3 | CC by nc sa | dragonet80 - 2013 | S1 | +C1 | R17 | +C2 | VR1.8 | VR5.0 | VR3.3 | +C3 | +C4 | +C5 | R21 | R20 | R19 | R18 | R9 | R10 | R11 | R12 | R13 | R14 | R15 | R16 | R24 | R1 | R2 | R3 | R4 | R5 | R6 | R7 | R8 | Q1 | SG1 | SW1 | R22 | R23 | S2 | S3 | S4 | S5 | S6 | S7 | S8 | S9